# EAGLE design MD (EAGLE 9.6.2)
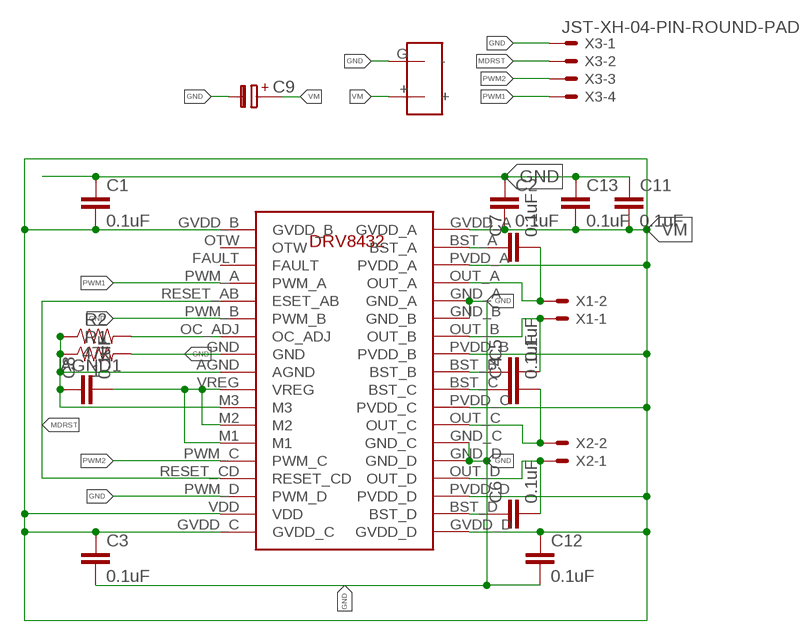
[diagram p0: schematic, sheet 1]

## Parts
C1  0.1uF  0.1UF-0603-100V-10%  [0603]
C2  0.1uF  0.1UF-0603-100V-10%  [0603]
C3  0.1uF  0.1UF-0603-100V-10%  [0603]
C4  0.1uF  0.1UF-0603-25V-(+80/-20%)  [0603]
C5  0.1uF  0.1UF-0603-25V-(+80/-20%)  [0603]
C6  0.1uF  0.1UF-0603-25V-(+80/-20%)  [0603]
C7  0.1uF  0.1UF-0603-25V-(+80/-20%)  [0603]
C8  0.1uF  0.1UF-0603-25V-(+80/-20%)  [0603]
C9  C-PR-3,5X8  [E3,5-8]
C11  0.1uF  0.1UF-0603-25V-(+80/-20%)  [0603]
C12  0.1uF  0.1UF-0603-100V-10%  [0603]
C13  0.1uF  0.1UF-0603-100V-10%  [0603]
R1  1  0OHM-0603-1/10W-5%  [0603]
R2  47k  47KOHM-0603-1/10W-1%  [0603]
U$1  DRV8432DKDR  [HSSOP-36]
U$2  BAT  [BAT]
X1  JST-XH-02-PIN-LONG-PAD  [JST-XH-02-PACKAGE-LONG-PAD]
X2  JST-XH-02-PIN-LONG-PAD  [JST-XH-02-PACKAGE-LONG-PAD]
X3  JST-XH-04-PIN-ROUND-PAD  [JST-XH-04-PACKAGE-ROUND-PAD]

## Nets
AGND1: C8.1 R1.1 R2.1 U$1.AGND U$1.M3
GND: C1.1 C2.1 C3.2 C9.- C11.1 C12.2 C13.1 R1.2 U$1.GND U$1.GND_A U$1.GND_B U$1.GND_C U$1.GND_D U$1.PWM_B U$1.PWM_D U$2.G(-) X3.1
M1_1 [MDpow]: C7.2 U$1.OUT_A X1.2
M1_2 [MDpow]: C5.2 U$1.OUT_B X1.1
M2_1 [MDpow]: C4.2 U$1.OUT_C X2.2
M2_2 [MDpow]: C6.2 U$1.OUT_D X2.1
MDRST: U$1.RESET_AB(ESET_AB) U$1.RESET_CD X3.2
N$5: C6.1 U$1.BST_D
N$6: C4.1 U$1.BST_C
N$7: C5.1 U$1.BST_B
N$8: C7.1 U$1.BST_A
N$12: R2.2 U$1.OC_ADJ
PWM1: U$1.PWM_A X3.4
PWM2: U$1.PWM_C X3.3
VM: C1.2 C2.2 C3.1 C9.+ C11.2 C12.1 C13.2 U$1.GVDD_A U$1.GVDD_B U$1.GVDD_C U$1.GVDD_D U$1.PVDD_A U$1.PVDD_B U$1.PVDD_C U$1.PVDD_D U$1.VDD U$2.+
VREG1: C8.2 U$1.M1 U$1.M2 U$1.VREG
Unconnected: U$1.FAULT U$1.OTW

## Library data of the parts
C1-C3 C12 C13 = SparkFun-Capacitors:0.1UF: 0.1µF ceramic capacitors A capacitor is a passive two-terminal electrical component used to store electrical energy temporarily in an electric field.; PROD_ID: CAP-08390
C4-C8 C11 = SparkFun-Capacitors:0.1UF: 0.1µF ceramic capacitors A capacitor is a passive two-terminal electrical component used to store electrical energy temporarily in an electric field.; PROD_ID: CAP-00810
C9 = cap-pan40:C-PR: POLARIZED ELECTROLYTIC/TANTALUM
R1 = SparkFun-Resistors:0OHM: 0Ω resistor A resistor is a passive two-terminal electrical component that implements electrical resistance as a circuit element. Resistors act to reduce current flow, and, at the same time, act to lower voltage levels within circuits. - Wikipedia; PROD_ID: RES-08609; VALUE: 0
R2 = SparkFun-Resistors:47KOHM: 47kΩ resistor A resistor is a passive two-terminal electrical component that implements electrical resistance as a circuit element. Resistors act to reduce current flow, and, at the same time, act to lower voltage levels within circuits. - Wikipedia; PROD_ID: RES-07871
U$1 = DRV8432DKDR:DRV8432DKDR
U$2 = BAT:BAT
X1 X2 = JST XH Connectors:JST-XH-02-PIN: JST XH Connector 2 Pin Wire to board connector. Pitch: 2,54 mm, (0.100") Number of pins: 2 Created by Rembrandt Electronics www.rembrandtelectronics.com
X3 = JST XH Connectors:JST-XH-04-PIN: JST XH Connector 2 Pin Wire to board connector. Pitch: 2,54 mm, (0.100") Number of pins: 4 Created by Rembrandt Electronics www.rembrandtelectronics.com

## Net classes
0 default: width 0.3 mm
3 MDpow: clearance 0.2 mm

## Board
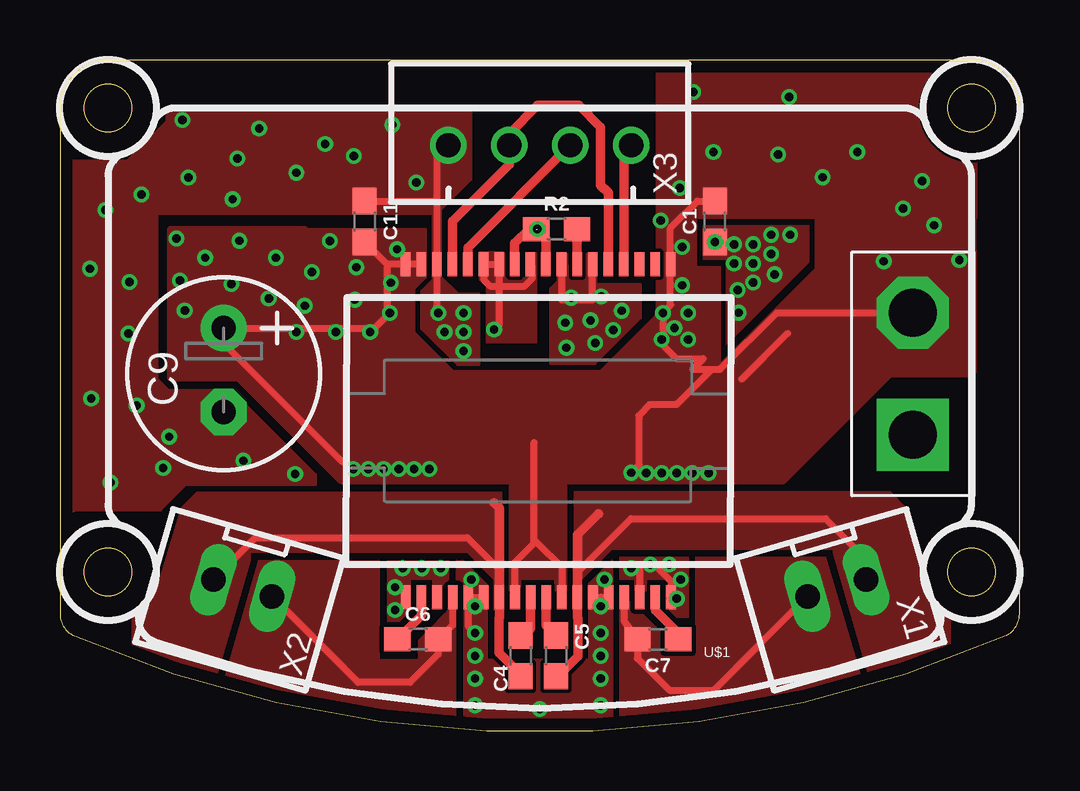
[diagram p1: board, top side]
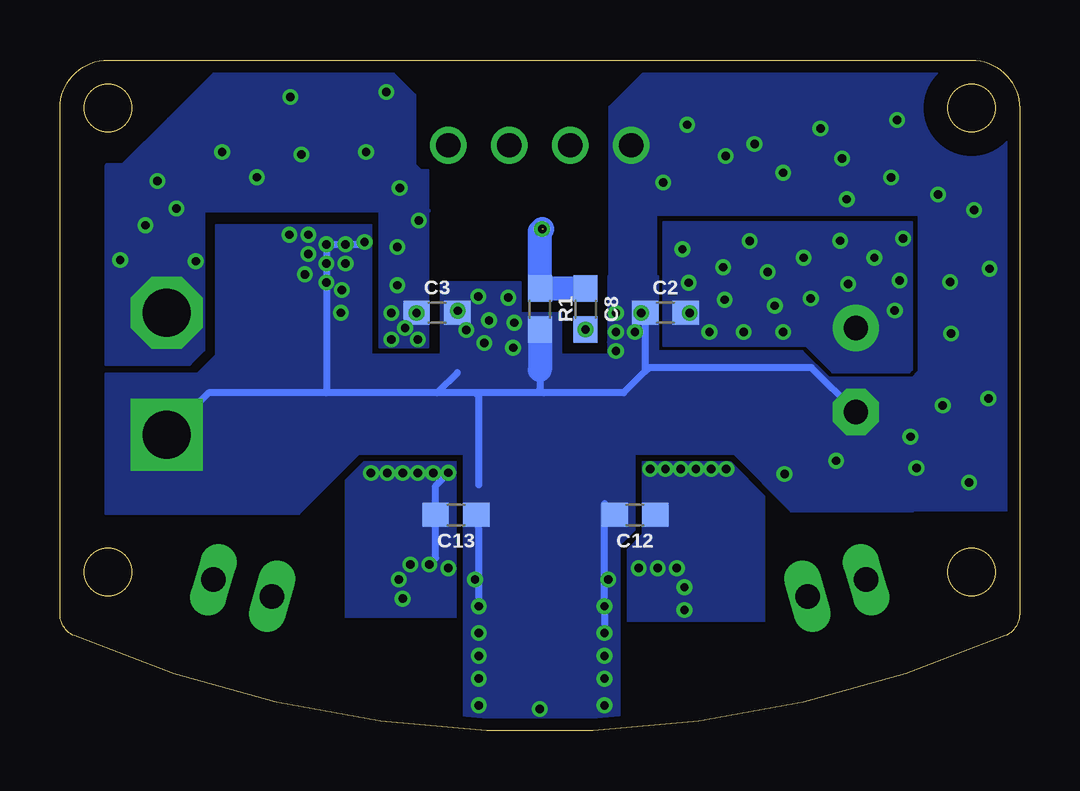
[diagram p2: board, bottom side, seen from below]

Size 40 x 27.95 mm. Coordinates in mm from the lower left corner, seen from the top.
Outline: 0,25.95 0,4.87 arc67 0.6,3.95 arc47 39.4,3.95 arc67 40,4.87 40,25.95 arc90 38,27.95 2,27.95 arc90 0,25.95
Outline: circle at 2,6.62 radius 1
Outline: circle at 2,25.95 radius 1
Outline: circle at 38,25.95 radius 1
Outline: circle at 38,6.62 radius 1
Copper layers (1*16): Top 0.035mm / dielectric 1.6mm / Bottom 0.035mm
Design rules "Elecrow_2-layer_PCB_eagle_rule": minimum track width 6mil, minimum drill 12mil, track to track 6mil, track to pad 6mil, pad to pad 6mil, via to via 8mil, smd to smd 0mil, copper to edge 20mil, drill to drill 10mil, minimum pad ring 6mil, minimum via ring 6mil, stop-mask expansion 0mil, vias tented up to drill 100mil, thermal gap 10mil
tRestrict: area 35.8,23.7 to 40.2,28.1
bRestrict: area 0.1,24 to 3.9,27.9

### Footprints (pad centres in the part's own frame; a part is rotated, then mirrored left to right if it is on the bottom)
0603 = smd 1.1 x 1: 1 -0.85,0; 2 0.85,0
E3,5-8 = drill 1.016 pad 1.93: + -1.905,0 | drill 1.016 pad 1.93 octagon: - 1.587,0
HSSOP-36 = smd 1 x 0.4: AGND -1.39,5.02; BST_A 12.49,9.58; BST_B 12.49,5.03; BST_C 12.49,4.38; BST_D 12.49,-0.17; FAULT -1.4,8.92; GND -1.39,5.67; GND_A 12.48,7.63; GND_B 12.49,6.98; GND_C 12.49,2.43; GND_D 12.49,1.78; GVDD_A 12.48,10.23; GVDD_B -1.4,10.22; GVDD_C -1.39,-0.83; GVDD_D 12.49,-0.82; M1 -1.39,2.42; M2 -1.39,3.07; M3 -1.39,3.72; OC_ADJ -1.39,6.32; OTW -1.39,9.57; OUT_A 12.48,8.28; OUT_B 12.49,6.33; OUT_C 12.49,3.08; OUT_D 12.49,1.13; PVDD_A 12.48,8.93; PVDD_B 12.49,5.68; PVDD_C 12.49,3.73; PVDD_D 12.49,0.48; PWM_A -1.4,8.27; PWM_B -1.39,6.97; PWM_C -1.39,1.77; PWM_D -1.39,0.47; RESET_AB -1.4,7.62; RESET_CD -1.39,1.12; VDD -1.39,-0.18; VREG -1.39,4.37
BAT = drill 2 octagon: + 2.54,0 | drill 2 square: G -2.54,0
JST-XH-02-PACKAGE-LONG-PAD = drill 1.016 long: 1 -1.27,0; 2 1.27,0
JST-XH-04-PACKAGE-ROUND-PAD = drill 1.016: 1 -3.81,0; 2 -1.27,0; 3 1.27,0; 4 3.81,0

### Placement (x,y rotation side)
C1  27.3,21.22 90 top
C2  14.76,17.41 0 bottom
C3  24.29,17.41 0 bottom
C4  19.21,3.13 270 top
C5  20.68,3.13 270 top
C6  14.92,3.81 0 top
C7  24.92,3.81 180 top
C8  18.09,17.57 270 bottom
C9  6.82,14.87 270 top
C11  12.7,21.22 270 top
C12  16.03,9 180 bottom
C13  23.49,9 180 bottom
R1  20,17.57 270 bottom
R2  20.7,20.91 0 top
U$1  15.24,18.05 270 top
U$2  35.56,14.87 90 top
X1  32.38,5.95 196 top
X2  7.62,5.95 164 top
X3  20,24.4 0 top

### Tracks (layer width: path | path; a pad name or v marks a point on that pad's centre or on a via)
AGND1  (via drill 0.35)  (1 unrouted)
  Top 0.3: 19.55,20.91 R2.1
  Top 0.4: U$1.M3 18.96,20.31 19.55,20.91 | R2.1 20.26,20.5 U$1.AGND
  Bottom 1: C8.1 R1.1 20,20.81 v19.9,20.91
GND  (via drill 0.35)
  Top 0.3: C11.1 15.61,22.07 15.71,22.18 | 15.71,22.18 U$1.PWM_D 15.71,17.48 v15.77,17.41 | U$1.PWM_B 22.21,17.96 20.91,17.96 U$1.GND | X3.1 15.71,23.92 15.71,22.18 | U$1.GND_B 22.38,5.39 22.38,5.57 22.54,5.57 | 22.54,5.57 U$1.GND_A | U$1.GND_C U$1.GND_D 17.02,4.36 v17.3,4.08 | 22.54,5.57 v22.54,5.19
  Bottom 0.3: C2.1 15.61,14.98 | 15.61,14.98 15.45,15.13 8.67,15.13 C9.- | 15.61,14.98 16.51,14.08 19.84,14.08 | U$2.G 33.81,14.08 28.89,14.08 | 19.84,14.08 22.7,14.08 | 22.7,14.08 24.29,14.08 | 24.29,14.08 28.89,14.08 | 19.84,14.08 20,14.24 20,15.03 | C1.1 27.41,20.27 v28.89,20.27 28.89,14.08 | v17.3,4.08 v17.3,5.19 17.3,9.47 C12.2 | v22.54,5.19 22.54,8.39 C13.1 | 22.54,10.24 22.54,13.92 22.7,14.08 | 23.44,14.93 24.29,14.08
  Bottom 1: R1.2 20,15.03
  other vias: 27.3,20.37 16.03,16.62 16.82,16.62 16.82,17.41 16.82,15.83 21.31,18.05 22.56,18.1 22.11,17.1 21.06,17 21.11,15.96 28.89,19.48 28.26,18.37 28.1,19.48 28.1,20.27 28.89,18.68 17.14,6.3 22.31,16.16 22.54,4.08 22.7,6.3 17.3,2.17 22.54,3.13 17.3,1.06 22.54,1.06 17.3,3.13 22.54,2.17 20,0.9 23.41,17.5 29.64,20.67 29.64,19.87 30.44,20.67 23.06,16.7 29.79,19.02 28.29,17.42 5.1,25.45 5.35,23.05 7.4,23.85 8.3,25.1 9.85,23.25 11.05,24.45 12.25,23.95 13.85,25.25 14.85,22.85 7.2,22.15 4.55,12.25 7.65,11.25 2.1,10.35 1.3,13.85 2.85,16.55 1.25,19.25 3.4,22.35 9.8,10.7 3.2,13.55 4.3,10.95 2.9,18.7 1.9,21.7
  pour Top (no thermals): 15.55,21.54 15.55,18.81 15.08,18.33 15.08,16.74 16.57,15.25 17.46,15.25 17.46,18.21 16.61,18.21 15.87,18.94 15.87,21.7 17.14,22.97 17.14,25.99 4.45,25.99 4.45,21.54
  pour Bottom (no thermals): 15.08,18.94 17.14,18.94 17.14,15.67 33.49,15.67 34.29,14.87 38.1,14.87 38.1,9.04 30.03,9.04 27.54,11.54 11.9,11.54 9.52,9.16 4.45,9.16 4.45,14.71 7.94,14.71 9.05,15.83 15.08,15.83
  pour Bottom (no thermals): 20.79,18.68 24.12,18.68 24.12,15.19 19.12,15.19 19.12,17.4 20.79,17.4
  pour Bottom (no thermals): 27.03,21.06 33.49,21.06 33.49,14.87 27.03,14.87
  pour Top (no thermals): 16.51,7.09 16.51,6.3 16.67,6.3 16.82,6.14 16.82,-0.05 17.83,-0.05 17.83,6.09 16.82,7.09
  pour Bottom (no thermals): 16.03,8.36 16.67,7.73 16.67,-0.21 23.18,-0.21 23.18,12.02 16.19,12.02 16.03,11.86
  pour Top (no thermals): 26.83,21.06 31.23,21.06 31.23,19.53 27.78,16.09 27.78,19.64 26.83,19.64
  pour Top (no thermals): 22.06,-0.05 22.06,6.14 23.02,7.09 23.02,-0.05
  pour Top: 16.98,2.97 23.02,2.97 23.02,-0.37 16.98,-0.37
  pour Top (no thermals): 20.75,19.9 20.75,18.75 20.45,18.45 20.45,15.3 22.3,15.3 24.2,17.2 24.2,18.6 22.35,18.6 22.35,19.85 20.8,19.85
  pour Bottom (no thermals): 17.1,26 17.1,16.25 17.15,16.2 15.1,16.2 15.1,18.9 15.15,18.95 15.15,21.5 4.2,21.5 4.2,15 4.5,14.7 7.85,14.7 7.85,9.2 -1.6,9.2 -2.1,9.7 -2.1,28.35 -1.6,28.85 14.25,28.85
  pour Top (no thermals): 4.55,14.2 7.15,14.2 10.65,10.7 10.65,10.25 5.25,10.25 4.2,9.2 0.6,9.2 0.55,9.15 0.55,23.75 2.8,23.75 2.9,23.85 4.45,25.4 4.45,25.95 5.95,25.95 5.75,25.75 5.75,21.55 4.25,21.55 4.1,21.55 4.05,21.5 4.05,14.7
M1_1
  Top 0.3: U$1.OUT_A 23.52,4.57 C7.2 24.07,3.02 25.4,1.7 27.26,1.7 X1.2
  pour Top (no thermals): 31.91,7.25 33.96,0.29 24.6,-0.53 23.65,-0.53 23.33,-0.21 23.33,5.98 23.65,5.98 23.65,5.51 25.08,4.08 25.08,3.13 26.51,3.13 26.51,7.25
M1_2
  Top 0.3: 20.75,2.28 C5.2 | U$1.OUT_B 21.57,6.6 23.81,8.84 31.91,8.84 33.6,7.14 X1.1
  Top 0.4: 20.75,2.28 21.59,3.11 21.59,4.69 21.57,4.71 U$1.OUT_B 21.57,8.17 22.45,9.05
  pour Top (no thermals): 32.22,7.41 34.29,0.27 37.3,1.86 37.3,2.33 37.14,2.49 37.14,4.71 36.35,5.35 35.24,9.32 34.61,9.95 21.43,9.95 21.43,5.03 21.75,5.03 21.75,6.3 23.02,7.57 32.22,7.57
M2_1
  Top 0.3: X2.2 8.14,8.05 16.98,8.05 18.32,6.71 U$1.OUT_C
  Top 0.4: C4.2 19.21,2.36 18.31,3.26 18.31,4.69 18.32,4.7 U$1.OUT_C 18.32,9.28 18.1,9.5
  pour Top (no thermals): 7.94,7.09 6.03,0.59 4.76,0.59 3.01,2.33 3.01,4.71 3.97,5.67 5.08,9.32 5.71,9.95 18.41,9.95 18.41,5.03 18.09,5.03 18.09,6.3 16.98,7.41 7.94,7.41
M2_2
  Top 0.3: X2.1 12.42,2.01 14.6,2.01 15.77,3.18 C6.2 16.37,4.41 U$1.OUT_D
  pour Top (no thermals): 8.25,7.09 6.35,0.43 7.14,-0.37 16.51,-0.37 16.51,5.35 14.92,3.76 14.92,2.97 13.33,2.97 13.33,7.09
MDRST
  Top 0.4: U$1.RESET_AB 22.86,22.41 22.54,22.73 22.54,25.15 21.63,26.06 19.91,26.06 18.73,24.88 X3.2 18.73,23.6 16.36,21.23 U$1.RESET_CD
N$5
  Top 0.4: U$1.BST_D 15.07,4.81 C6.1
N$6
  Top 0.3: 19.31,3.95 C4.1
  Top 0.4: U$1.BST_C 19.62,4.26 19.31,3.95
N$7
  Top 0.4: U$1.BST_B 20.27,4.39 C5.1
N$8
  Top 0.4: U$1.BST_A 24.82,5.02 25.77,4.07 C7.1
N$12
  Top 0.3: R2.2
  Top 0.4: U$1.OC_ADJ R2.2
PWM1
  Top 0.4: U$1.PWM_A 23.51,24.1 X3.4
PWM2
  Top 0.4: X3.3 17.01,20.14 U$1.PWM_C
VM  (via drill 0.35)
  Top 0.3: C1.2 26.57,22.07 25.46,20.97 U$1.GVDD_B 25.46,17.73 C3.1 25.14,16.06 25.69,15.51 26.82,15.51 26.37,15.06 27.17,15.06 | 13.63,19.44 U$1.GVDD_C U$1.VDD | 13.63,19.44 C11.2 | 13.63,19.44 13.63,17.53 v13.75,17.41 13.12,16.78 C9.+ 6.82,16.14 11.74,11.22 | U$2.+ 29.88,17.41 27.52,15.06 27.17,15.06 | 27.17,15.06 25.71,13.6 24.6,13.6 24.13,13.13 24.13,11.07 v23.81,10.75 | U$1.PVDD_C 18.97,7.01 19.76,7.81 | 19.76,7.81 19.84,7.89 20.92,6.81 U$1.PVDD_B | 19.76,7.81 19.76,12.02 | U$1.PVDD_A 24.17,6.94 v24.6,6.94 24.76,6.94 25.47,6.23 U$1.GVDD_A | 28.42,14.66 30.32,16.56
  Bottom 0.3: v24.6,6.94 24.34,7.2 C13.2 24.34,10.22 v23.81,10.75
  other vias: 25.14,17.41 10.2,17.71 7.14,18.61 12.29,17.96 9.85,16.62 11.49,16.62 13.79,18.67 7.48,20.42 12.93,16.62 26.19,17.41 26.19,16.3 25.08,16.3 14.29,6.78 15.08,6.78 15.87,6.78 13.97,5.98 13.97,5.03 23.81,6.78 25.4,6.94 25.87,6.3 25.71,5.51 12.22,10.9 12.86,10.9 13.49,10.9 14.13,10.9 14.76,10.9 15.4,10.9 24.45,10.75 25.08,10.75 25.71,10.75 26.35,10.75 27.04,10.74 25.61,16.78 25.94,18.56 25.94,20.16 25.04,21.26 25.84,22.61 10.5,19.11 9,19.71 6.05,19.71 5,18.76 8.7,18.01 5.2,17.51 4.85,20.51 11.25,20.41 14.05,20.06 12.35,19.31 27.24,24.11 29.94,24.01 31.79,23.06 33.24,24.11 35.94,22.91 34.34,19.56 37.49,19.61 36.44,21.06 35.14,21.76 30.39,26.41 26.39,26.61
  pour Top (no thermals): 4.6,20.88 4.6,14.71 7.43,14.71 11.71,10.43 30.16,10.43 34.61,14.87 37.94,14.87 38.1,15.03 38.1,19.95 37.94,20.11 32.49,20.11 27.25,14.87 16.21,14.87 10.2,20.88
  pour Top (no thermals): 15.24,20.91 15.24,18.87 14.76,18.4 14.76,16.63 17.15,14.24 10.12,14.24 10.12,20.91
  pour Bottom (no thermals): 24.65,23.34 26.67,23.34 26.67,15.98 24.65,15.98
  pour Top (no thermals): 24.89,27.8 24.89,17.36 22.54,15.01 22.54,14.4 27.51,14.4 27.51,19.32 26.51,19.32 26.51,21.38 38.2,21.38 38.2,27.8
  pour Top (no thermals): 13.65,7.09 16.19,7.09 16.19,6.3 15.87,5.98 15.87,5.19 15.55,5.19 15.55,6.3 14.6,6.3 14.6,5.03 14.13,4.55 13.65,4.55
  pour Top (no thermals): 23.97,5.82 23.97,6.3 23.33,6.3 23.33,7.25 26.19,7.25 26.19,4.71 25.71,4.71 25.4,5.03 25.4,6.3 24.45,6.3 24.45,5.82
  pour Top (no thermals): 18.73,5.82 18.73,10.59 21.11,10.59 21.11,5.82 20.64,5.82 20.64,6.3 19.21,6.3 19.21,5.98 19.05,5.82
  pour Bottom (no thermals): 10.63,4.55 16.35,4.55 16.35,7.57 15.71,8.21 15.71,11.22 12.06,11.22 10.63,9.79
  pour Bottom (no thermals): 23.49,4.7 28.1,4.7 28.1,10.45 27.33,11.22 23.49,11.22
  pour Bottom (no thermals): 4.5,21.2 4.5,15.05 4.6,14.95 7.8,14.95 8.9,16.05 14.85,16.05 14.85,21.2
  pour Bottom (no thermals): 24.6,21.65 34,21.65 34,15.85 34.55,15.3 34.6,15.25 38.1,15.25 38.1,23.55 38.05,23.6 37.4,23.6 35.5,25.5 33.6,27.4 26.1,27.4 25.2,26.5 25.2,23.6 24.95,23.35 24.65,23.35 24.65,21.75 24.6,21.7
  pour Top (no thermals): 31.5,22 31.5,18.95 34.8,15.65 37.95,15.65 38.15,15.85 38.15,22.95 38,23.1 32.6,23.1
VREG1  (via drill 0.35)
  Top 0.3: U$1.VREG 19.68,19.36 19.68,18.84 19.36,18.52 18.25,18.52 | 18.25,18.52 17.94,18.52 17.66,18.8 U$1.M1 U$1.M2 18.31,18.58 | 18.31,18.58 18.25,18.52 | 18.31,18.58 18.31,16.93 C8.2
  other vias: 18.09,16.72
  pour Top (no thermals): 17.5,19.95 17.5,18.8 17.8,18.5 17.8,18.25 17.8,16.2 19.85,16.2 19.85,19.9 19.45,19.9 19.45,18.85 18.5,18.85 18.5,19.9 18.45,19.95